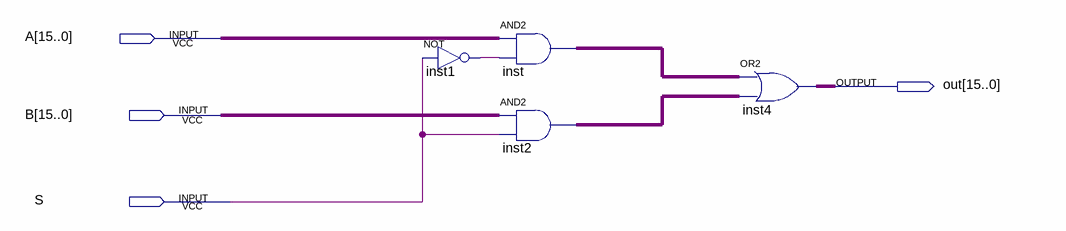
[diagram p0: schematic sheet]
// Quartus schematic mux2116.bdf as structural Verilog: 4 symbols, 4 pins
module mux2116 (
  input  [15:0] A,
  input  [15:0] B,
  input  S,
  output [15:0] out
);

  wire inst1_out;
  wire [15:0] inst2_out, inst_out;

  not inst1 (inst1_out, S);
  assign inst_out = A & {16{inst1_out}};  // AND2 inst, 16 bits wide
  assign inst2_out = B & {16{S}};  // AND2 inst2, 16 bits wide
  assign out = inst_out | inst2_out;  // OR2 inst4, 16 bits wide
endmodule
